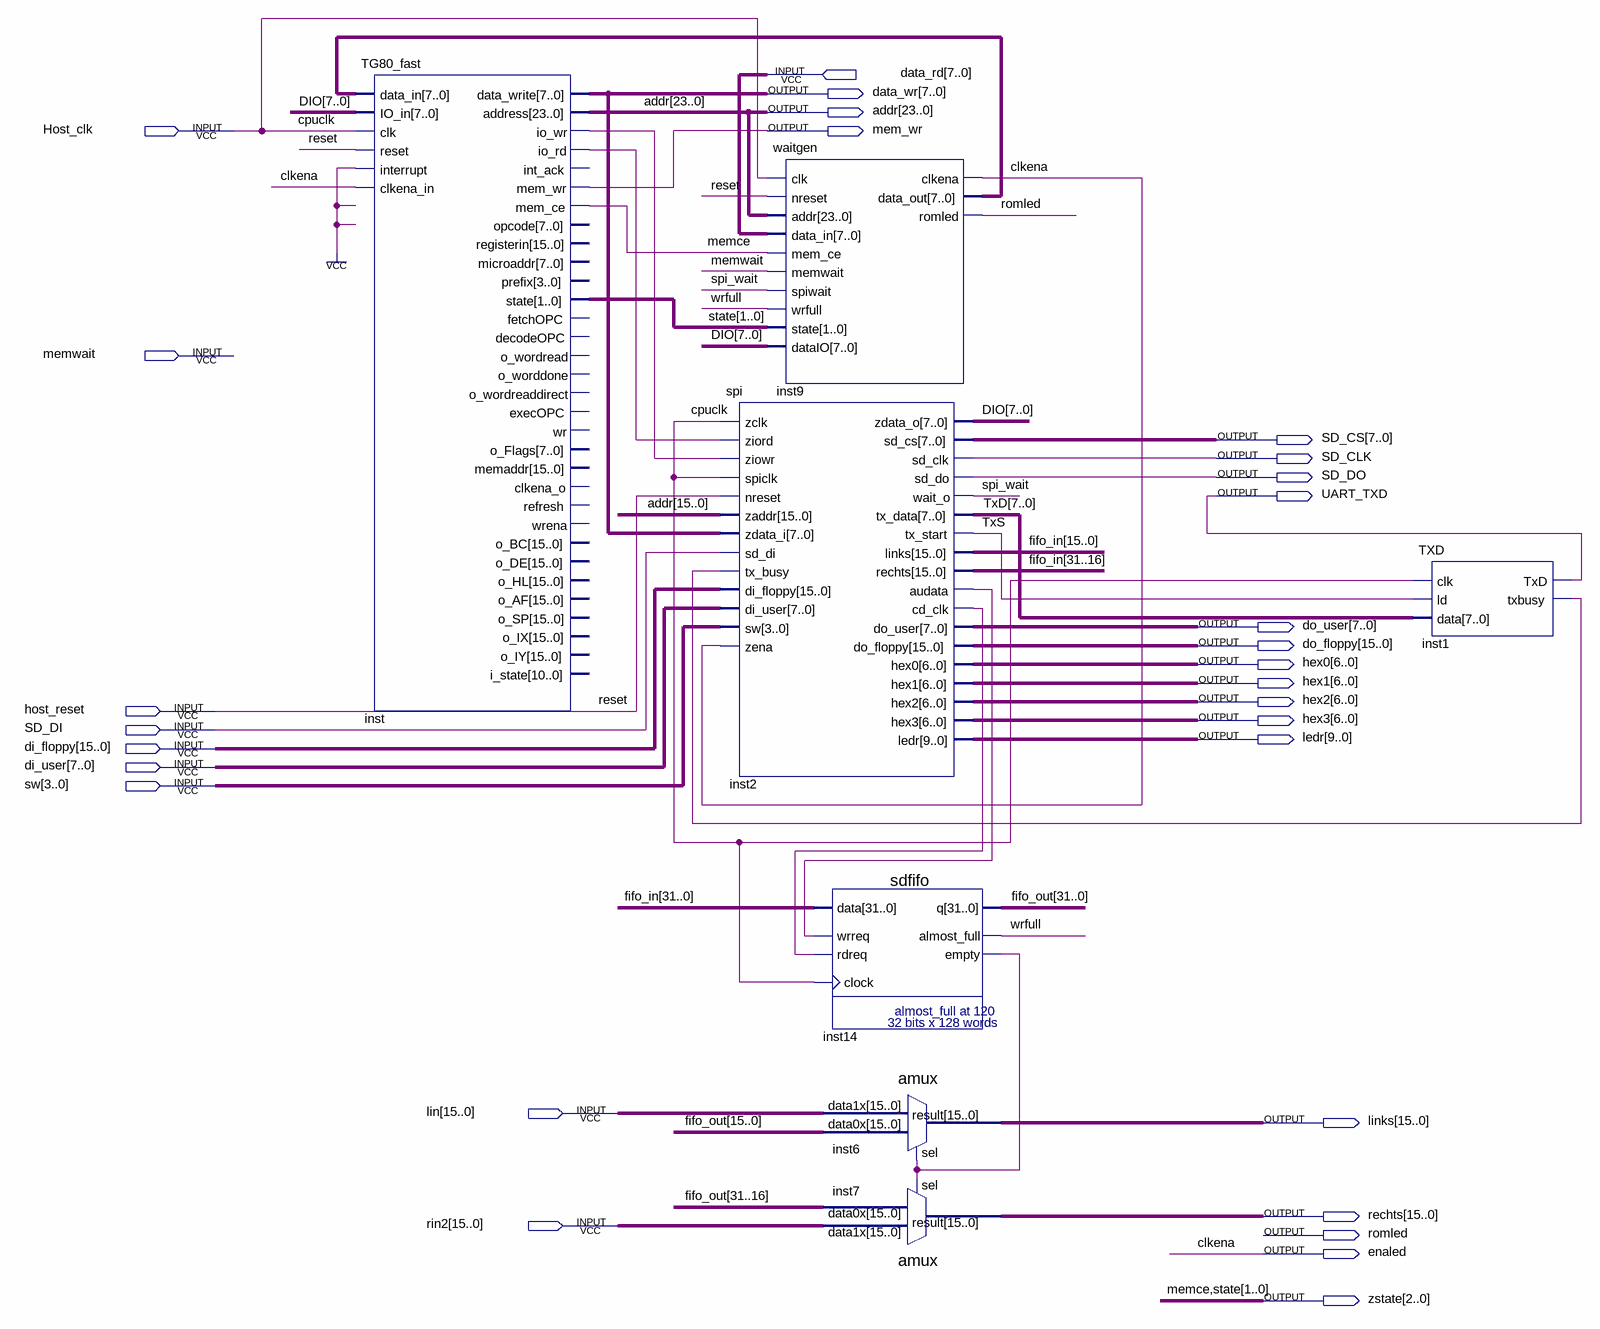
[diagram p0: schematic sheet]
// Quartus schematic spihost.bdf as structural Verilog: 7 symbols, 29 pins
module spihost (
  input  [7:0] data_rd,
  input  Host_clk,
  input  memwait,
  input  host_reset,
  input  SD_DI,
  input  [15:0] di_floppy,
  input  [7:0] di_user,
  input  [3:0] sw,
  input  [15:0] lin,
  input  [15:0] rin2,
  output [7:0] data_wr,
  output [23:0] addr,
  output mem_wr,
  output [7:0] SD_CS,
  output SD_CLK,
  output SD_DO,
  output UART_TXD,
  output [7:0] do_user,
  output [15:0] do_floppy,
  output [6:0] hex0,
  output [6:0] hex1,
  output [6:0] hex2,
  output [6:0] hex3,
  output [9:0] ledr,
  output [15:0] links,
  output [15:0] rechts,
  output romled,
  output enaled,
  output [2:0] zstate
);

  wire inst1_txbusy, inst2_audata, inst2_cd_clk, inst14_empty, inst_io_rd, inst_io_wr, spi_wait, TxS, wrfull;
  wire [7:0] DIO, inst9_data_out, TxD;
  wire [31:0] fifo_in, fifo_out;

  TG80_fast inst (
    .data_in(inst9_data_out), .IO_in(DIO), .clk(Host_clk), .reset(host_reset), .interrupt(1'b1),
    .clkena_in(enaled), .data_write(data_wr), .address(addr), .io_wr(inst_io_wr), .io_rd(inst_io_rd),
    .mem_wr(mem_wr), .mem_ce(zstate[2]), .state(zstate[1:0]));  // open: int_ack, opcode, registerin, microaddr, prefix, fetchOPC, decodeOPC, o_wordread, o_worddone, o_wordreaddirect, execOPC, wr, o_Flags, memaddr, clkena_o, refresh, wrena, o_BC, o_DE, o_HL, o_AF, o_SP, o_IX, o_IY, i_state
  spi inst2 (
    .zclk(Host_clk), .ziord(inst_io_rd), .ziowr(inst_io_wr), .spiclk(Host_clk), .nreset(host_reset),
    .zaddr(addr[15:0]), .zdata_i(data_wr), .sd_di(SD_DI), .tx_busy(inst1_txbusy), .di_floppy(di_floppy),
    .di_user(di_user), .sw(sw), .zena(enaled), .zdata_o(DIO), .sd_cs(SD_CS), .sd_clk(SD_CLK), .sd_do(SD_DO),
    .wait_o(spi_wait), .tx_data(TxD), .tx_start(TxS), .links(fifo_in[15:0]), .rechts(fifo_in[31:16]),
    .audata(inst2_audata), .cd_clk(inst2_cd_clk), .do_user(do_user), .do_floppy(do_floppy), .hex0(hex0),
    .hex1(hex1), .hex2(hex2), .hex3(hex3), .ledr(ledr));
  waitgen inst9 (
    .clk(Host_clk), .nreset(host_reset), .addr(addr), .data_in(data_rd), .mem_ce(zstate[2]),
    .memwait(memwait), .spiwait(spi_wait), .wrfull(wrfull), .state(zstate[1:0]), .dataIO(DIO),
    .clkena(enaled), .data_out(inst9_data_out), .romled(romled));
  sdfifo inst14 (
    .data(fifo_in), .wrreq(inst2_audata), .rdreq(inst2_cd_clk), .clock(Host_clk), .q(fifo_out),
    .almost_full(wrfull), .empty(inst14_empty));
  amux inst6 (.data1x(lin), .data0x(fifo_out[15:0]), .sel(inst14_empty), .result(links));
  amux inst7 (.data1x(rin2), .data0x(fifo_out[31:16]), .sel(inst14_empty), .result(rechts));
  TXD inst1 (.clk(Host_clk), .ld(TxS), .data(TxD), .TxD(UART_TXD), .txbusy(inst1_txbusy));

  // Other names for the same wires on the sheet: clkena = enaled; cpuclk = Host_clk; memce = zstate[2];
  //   reset = host_reset; state[1:0] = zstate[1:0]
endmodule
